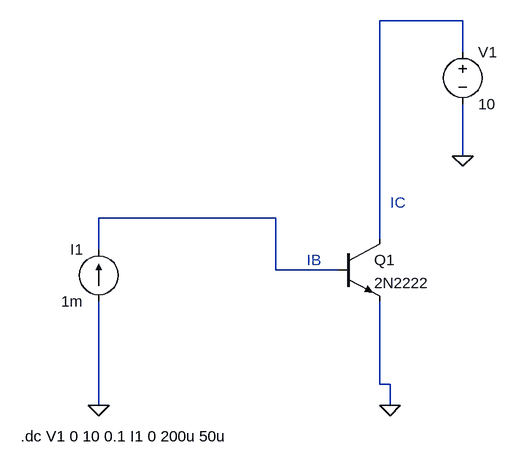
[diagram p0: schematic Schema1.asc]
Schema1.asc, the LTspice schematic file:
Version 4.1
SHEET 1 880 680
WIRE 208 -192 80 -192
WIRE 208 -144 208 -192
WIRE 208 16 208 -64
WIRE -80 112 -352 112
WIRE 80 144 80 -192
WIRE -352 160 -352 112
WIRE -80 192 -80 112
WIRE 16 192 -80 192
WIRE 80 368 80 240
WIRE 96 368 80 368
WIRE -352 400 -352 240
WIRE 96 400 96 368
FLAG -352 400 0
FLAG 96 400 0
FLAG 208 16 0
SYMBOL current -352 240 R180
WINDOW 0 24 80 Left 2
WINDOW 3 24 0 Left 2
SYMATTR InstName I1
SYMATTR Value 1m
SYMBOL voltage 208 -160 R0
SYMATTR InstName V1
SYMATTR Value 10
SYMBOL npn 16 144 R0
SYMATTR InstName Q1
SYMATTR Value 2N2222
TEXT -472 448 Left 2 !.dc V1 0 10 0.1 I1 0 200u 50u
TEXT -32 176 Left 2 ;IB
TEXT 96 88 Left 2 ;IC

The netlist it stands for:
* Schema1.asc
I1 0 N002 1m
V1 N001 0 10
Q1 N001 N002 0 0 2N2222
.model NPN NPN
.model PNP PNP
.lib standard.bjt
.dc V1 0 10 0.1 I1 0 200u 50u
* IB
* IC
.backanno
.end